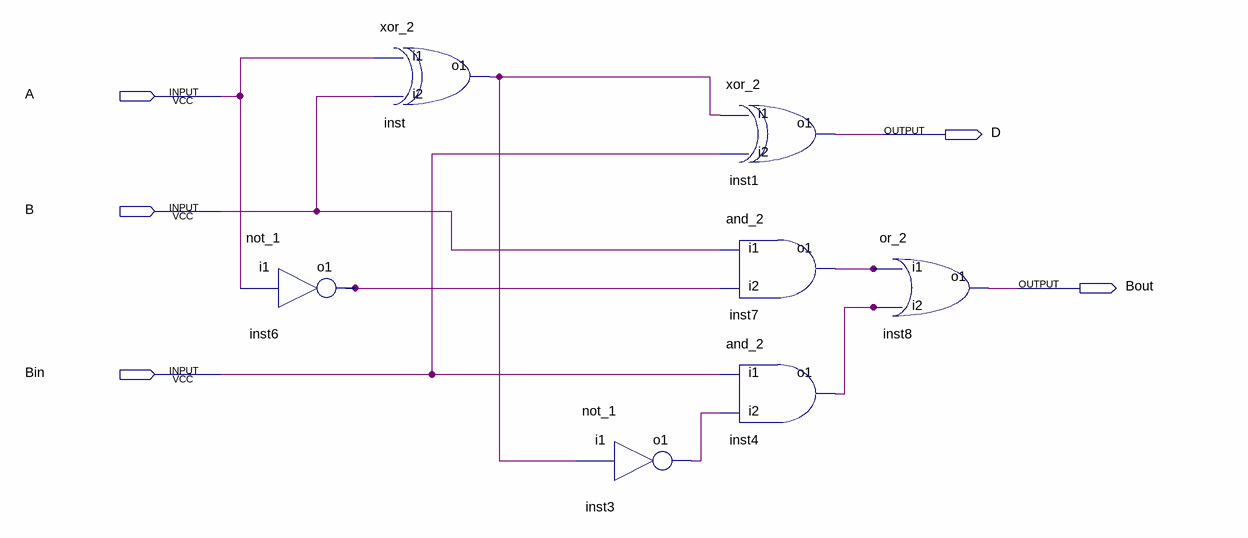
[diagram p0: schematic sheet]
// Quartus schematic fullsubtractor1.bdf as structural Verilog: 7 symbols, 5 pins
module fullsubtractor1 (
  input  A,
  input  B,
  input  Bin,
  output D,
  output Bout
);

  wire inst3_o1, inst4_o1, inst6_o1, inst7_o1, inst_o1;

  not_1 inst6 (.i1(A), .o1(inst6_o1));
  xor_2 inst (.i1(A), .i2(B), .o1(inst_o1));
  not_1 inst3 (.i1(inst_o1), .o1(inst3_o1));
  xor_2 inst1 (.i1(inst_o1), .i2(Bin), .o1(D));
  and_2 inst7 (.i1(B), .i2(inst6_o1), .o1(inst7_o1));
  and_2 inst4 (.i1(Bin), .i2(inst3_o1), .o1(inst4_o1));
  or_2 inst8 (.i1(inst7_o1), .i2(inst4_o1), .o1(Bout));
endmodule
